# EAGLE design ECNG3020 (EAGLE 9.5.1)
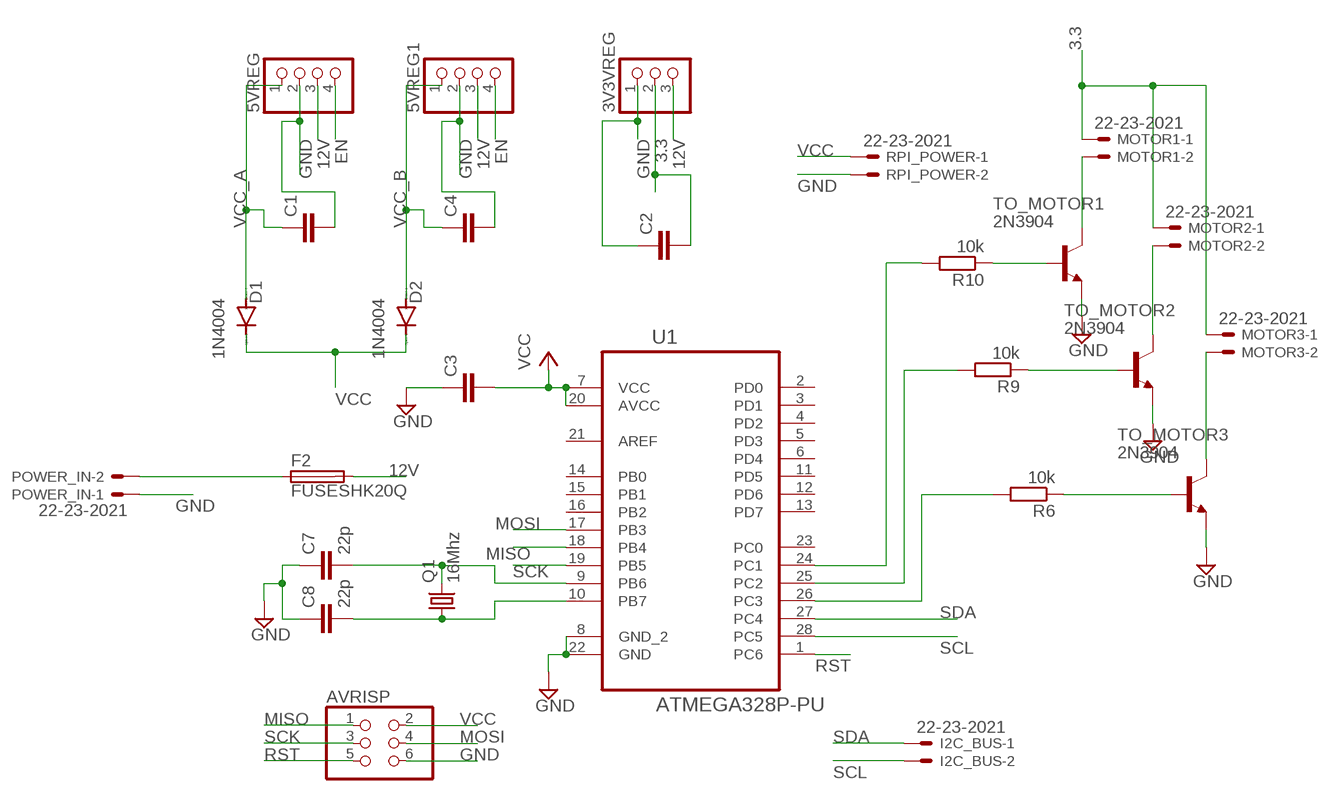
[diagram p0: schematic, sheet 1]

## Parts
3V3VREG  PINHD-1X3M  [1X03M]
5VREG  PINHD-1X4M  [1X04M]
5VREG1  PINHD-1X4M  [1X04M]
AVRISP  PINHD-2X3  [2X03]
C1  C2,5-3  [C2.5-3]
C2  C2,5-3  [C2.5-3]
C3  C2,5-3  [C2.5-3]
C4  C2,5-3  [C2.5-3]
C7  22p  C-EU050-024X044  [C050-024X044]
C8  22p  C-EU050-024X044  [C050-024X044]
D1  1N4004  [DO41-10]
D2  1N4004  [DO41-10]
F2  FUSESHK20Q  [SHK20Q]
I2C_BUS  22-23-2021  [22-23-2021]
MOTOR1  22-23-2021  [22-23-2021]
MOTOR2  22-23-2021  [22-23-2021]
MOTOR3  22-23-2021  [22-23-2021]
POWER_IN  22-23-2021  [22-23-2021]
Q1  16Mhz  CRYSTALHC49S  [HC49/S]
R6  10k  R-EU_0207/10  [0207/10]
R9  10k  R-EU_0207/10  [0207/10]
R10  10k  R-EU_0207/10  [0207/10]
RPI_POWER  22-23-2021  [22-23-2021]
TO_MOTOR1  2N3904  [TO92]
TO_MOTOR2  2N3904  [TO92]
TO_MOTOR3  2N3904  [TO92]
U1  ATMEGA328P-PU  [DIP254P762X457-28]

## Nets
3.3: 3V3VREG.2 C2.2 MOTOR1.1 MOTOR2.1 MOTOR3.1
12V: 3V3VREG.3 5VREG1.3 5VREG.3 F2.2A
EN: 5VREG1.4 5VREG.4
GND: 3V3VREG.1 5VREG1.2 5VREG.2 AVRISP.6 C1.2 C2.1 C3.1 C4.2 C7.1 C8.1 POWER_IN.1 RPI_POWER.2 TO_MOTOR1.3(E) TO_MOTOR2.3(E) TO_MOTOR3.3(E) U1.8(GND_2) U1.22(GND)
MISO: AVRISP.1 U1.18(PB4)
MOSI: AVRISP.4 U1.17(PB3)
N$1: R10.2 U1.24(PC1)
N$2: R9.2 U1.25(PC2)
N$3: C7.2 Q1.2 U1.9(PB6)
N$4: R6.2 U1.26(PC3)
N$5: C8.2 Q1.1 U1.10(PB7)
N$6: R10.1 TO_MOTOR1.2(B)
N$10: MOTOR3.2 TO_MOTOR3.1(C)
N$11: MOTOR2.2 TO_MOTOR2.1(C)
N$12: MOTOR1.2 TO_MOTOR1.1(C)
N$13: F2.1A POWER_IN.2
N$14: R9.1 TO_MOTOR2.2(B)
N$15: R6.1 TO_MOTOR3.2(B)
RST: AVRISP.5 U1.1(PC6)
SCK: AVRISP.3 U1.19(PB5)
SCL: I2C_BUS.2 U1.28(PC5)
SDA: I2C_BUS.1 U1.27(PC4)
VCC: AVRISP.2 C3.2 D1.C D2.C RPI_POWER.1 U1.7(VCC) U1.20(AVCC)
VCC_A: 5VREG.1 C1.1 D1.A
VCC_B: 5VREG1.1 C4.1 D2.A
Unconnected: U1.2(PD0) U1.3(PD1) U1.4(PD2) U1.5(PD3) U1.6(PD4) U1.11(PD5) U1.12(PD6) U1.13(PD7) U1.14(PB0) U1.15(PB1) U1.16(PB2) U1.21(AREF) U1.23(PC0)

## Library data of the parts
3V3VREG = pinhead_2:PINHD-1X3: PIN HEADER
5VREG 5VREG1 = pinhead_2:PINHD-1X4: PIN HEADER
AVRISP = pinhead_2:PINHD-2X3: PIN HEADER
C1-C4 = capacitor-wima:C: CAPACITOR naming: grid - package width
C7 C8 = rcl:C-EU: CAPACITOR, European symbol; SPICEPREFIX: C
D1 D2 = diode:1N4004: DIODE general purpose rectifier, 1 A
F2 = fuse:FUSE: Fuse; OC_FARNELL: unknown; OC_NEWARK: unknown
I2C_BUS MOTOR1-MOTOR3 POWER_IN RPI_POWER = con-molex:22-23-2021: .100" (2.54mm) Center Header - 2 Pin; MF: MOLEX; MPN: 22-23-2021; OC_FARNELL: 1462926; OC_NEWARK: 25C3832
Q1 = crystal:CRYSTAL: CRYSTAL; OC_FARNELL: 1667008; OC_NEWARK: unknown
R6 R9 R10 = rcl:R-EU_: RESISTOR, European symbol; SPICEPREFIX: R
TO_MOTOR1-TO_MOTOR3 = transistor-neu-to92:2N3904: NPN TRANSISTOR
U1 = ATMEGA328P-PU:ATMEGA328P-PU: 8-bit Microcontroller with In-System Programmable Flash Buy Part <https://snapeda.com/parts/ATMEGA328P-PU/Microchip/view-part/?ref=eda>; AVAILABILITY: Good; DESCRIPTION: AVR AVR® ATmega Microcontroller IC 8-Bit 20MHz 32KB (16K x 16) FLASH 28-PDIP; DIGIKEY-PURCHASE-URL: https://snapeda.com/shop?store=DigiKey&id=2895131; MF: Microchip; MOUSER-PURCHASE-URL: https://snapeda.com/shop?store=Mouser&id=2895131; MP: ATMEGA328P-PU; PACKAGE: DIP-28 Generic; PRICE: None

## Board
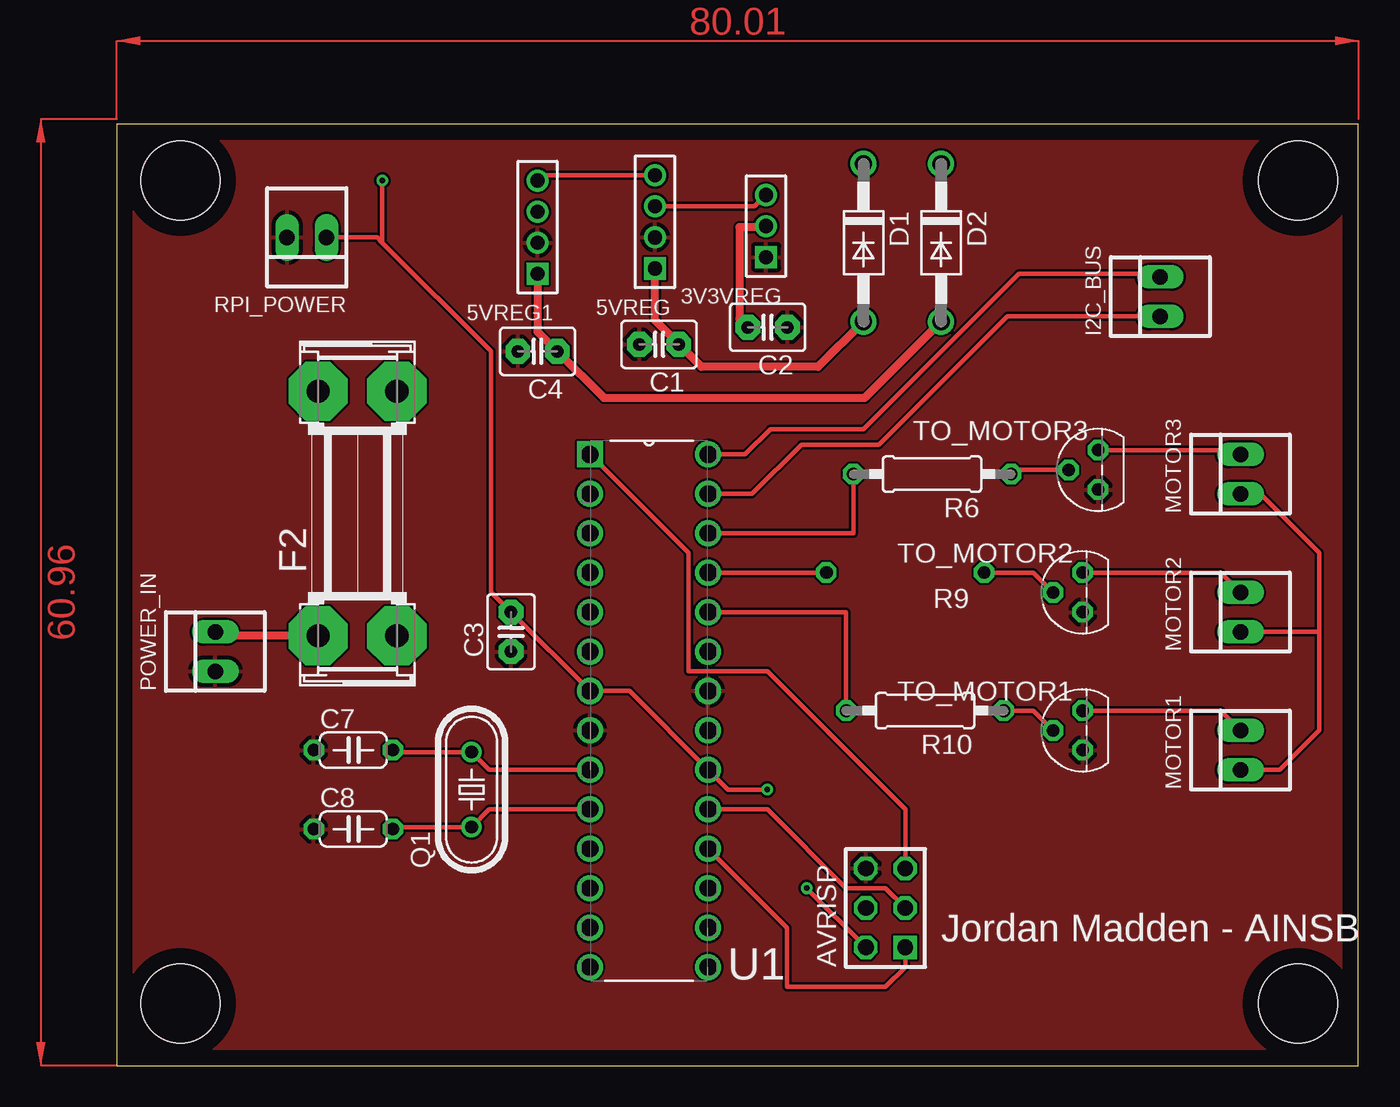
[diagram p1: board, top side]
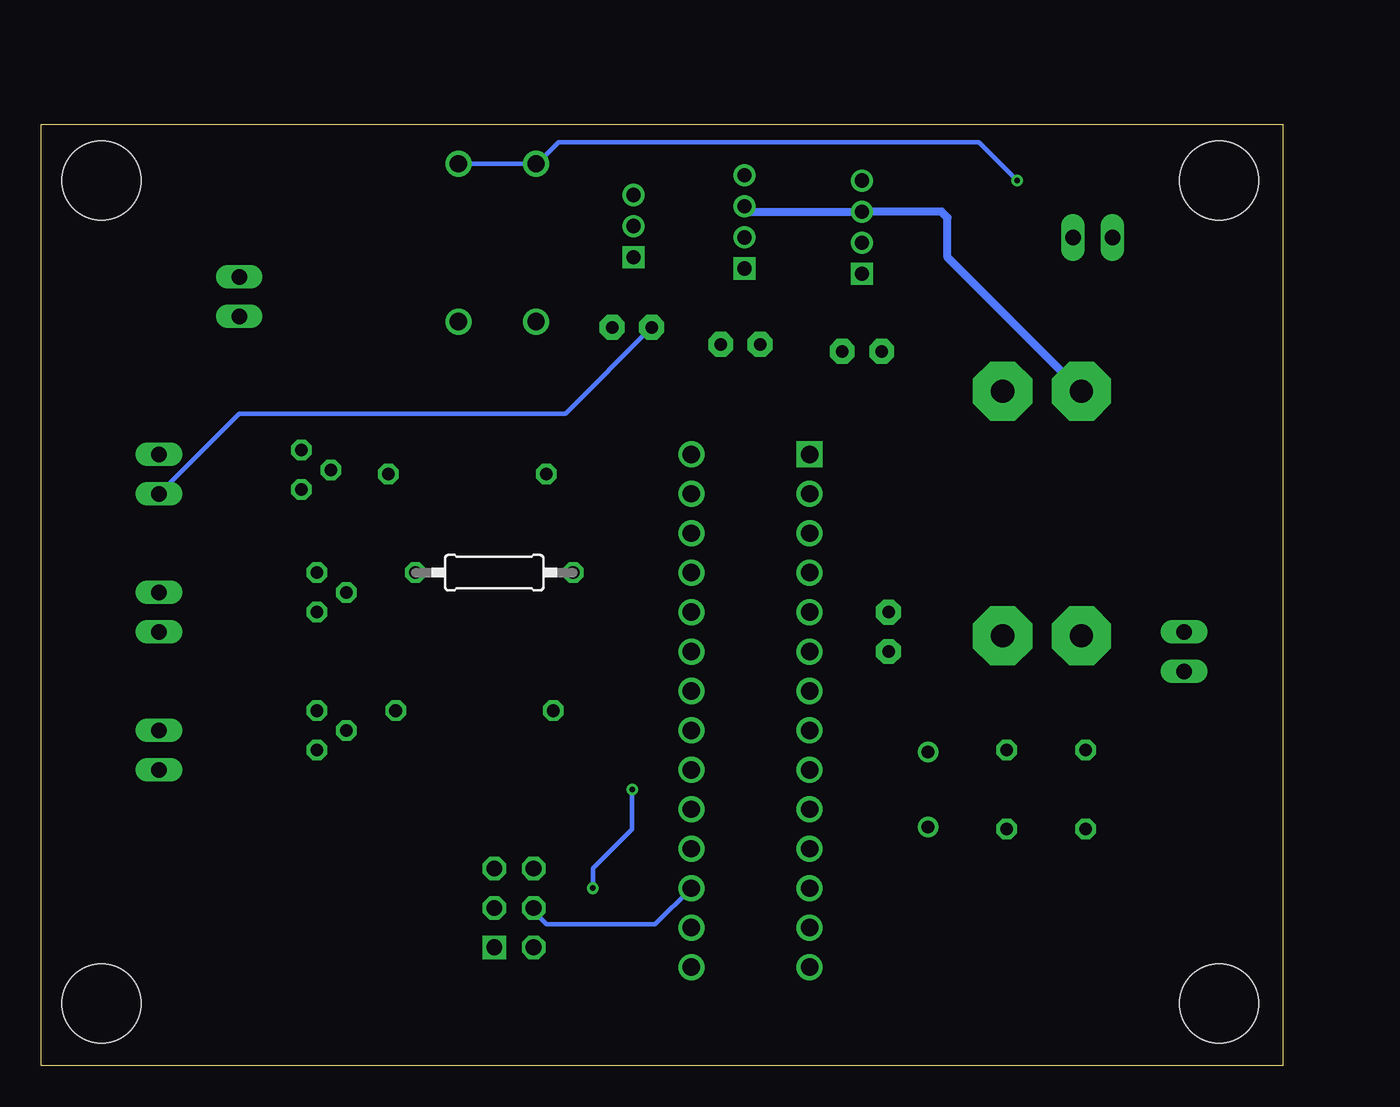
[diagram p2: board, bottom side, seen from below]

Size 79.99 x 60.63 mm. Coordinates in mm from the lower left corner, seen from the top.
Outline: 0,0 79.99,0 79.99,60.63 0,60.63 0,0
Copper layers (1*16): Top 0.035mm / dielectric 1.5mm / Bottom 0.035mm
Design rules "default": minimum track width 6mil, minimum drill 0.35mm, track to track 6mil, track to pad 6mil, pad to pad 6mil, via to via 6mil, smd to smd 6mil, copper to edge 40mil, drill to drill 6mil, minimum pad ring 10mil, minimum via ring 8mil, stop-mask expansion 4mil, vias tented up to drill 0mil, thermal gap 10mil
Holes 5.08 mm at 4.11,57 76.11,57 76.11,4 4.11,4

### Footprints (pad centres in the part's own frame; a part is rotated, then mirrored left to right if it is on the bottom)
1X03M = drill 0.914 square: 1 -2,0 | drill 0.914: 2 0,0; 3 2,0
1X04M = drill 0.914 square: 1 -3,0 | drill 0.914: 2 -1,0; 3 1,0; 4 3,0
2X03 = drill 1.016 square: 1 -2.54,-1.27 | drill 1.016 octagon: 2 -2.54,1.27; 3 0,-1.27; 4 0,1.27; 5 2.54,-1.27; 6 2.54,1.27
C2.5-3 = drill 0.813 pad 1.6 octagon: 1 -1.27,0; 2 1.27,0
C050-024X044 = drill 0.813 octagon: 1 -2.54,0; 2 2.54,0
DO41-10 = drill 1.118: A 5.08,0; C -5.08,0
SHK20Q = drill 1.5 pad 3.81 octagon: 1A -7.874,2.54; 1B -7.874,-2.54; 2A 7.874,2.54; 2B 7.874,-2.54
22-23-2021 = drill 1 long: 1 -1.27,0; 2 1.27,0
HC49/S = drill 0.813: 1 -2.413,0; 2 2.413,0
0207/10 = drill 0.813 octagon: 1 -5.08,0; 2 5.08,0
TO92 = drill 0.813 octagon: 1 1.27,0; 2 0,1.905; 3 -1.27,0
DIP254P762X457-28 = drill 1.118 square: 1 -7.62,33.02 | drill 1.118: 2 -7.62,30.48; 3 -7.62,27.94; 4 -7.62,25.4; 5 -7.62,22.86; 6 -7.62,20.32; 7 -7.62,17.78; 8 -7.62,15.24; 9 -7.62,12.7; 10 -7.62,10.16; 11 -7.62,7.62; 12 -7.62,5.08; 13 -7.62,2.54; 14 -7.62,0; 15 0,0; 16 0,2.54; 17 0,5.08; 18 0,7.62; 19 0,10.16; 20 0,12.7; 21 0,15.24; 22 0,17.78; 23 0,20.32; 24 0,22.86; 25 0,25.4; 26 0,27.94; 27 0,30.48; 28 0,33.02

### Placement (x,y rotation side)
3V3VREG  41.83,54.07 90 top
5VREG  34.67,54.34 90 top
5VREG1  27.11,54 90 top
AVRISP  49.53,10.16 90 top
C1  34.94,46.45 180 top
C2  41.93,47.55 180 top
C3  25.4,27.94 90 top
C4  27.11,46 180 top
C7  15.24,20.32 0 top
C8  15.24,15.24 0 top
D1  48.11,53 270 top
D2  53.11,53 270 top
F2  15.51,35.56 90 top
I2C_BUS  67.23,49.53 90 top
MOTOR1  72.39,20.32 90 top
MOTOR2  72.39,29.21 90 top
MOTOR3  72.39,38.1 90 top
POWER_IN  6.35,26.67 90 top
Q1  22.86,17.78 90 top
R6  52.53,38.1 180 top
R9  50.8,31.75 0 bottom
R10  52.07,22.86 180 top
RPI_POWER  12.24,53.34 180 top
TO_MOTOR1  62.23,21.59 90 top
TO_MOTOR2  62.23,30.48 90 top
TO_MOTOR3  63.23,38.37 90 top
U1  38.1,6.35 0 top

### Tracks (layer width: path | path; a pad name or v marks a point on that pad's centre or on a via)
3.3
  Top 0.305: MOTOR3.1 73.66,36.83 77.47,33.02 77.47,27.94 | 77.47,27.94 77.47,21.59 74.93,19.05 MOTOR1.1 | MOTOR2.1 77.47,27.94
  Top 0.508: 3V3VREG.2 41.76,54 40.11,54 40.11,48.1 C2.2
  Bottom 0.305: C2.2 46.21,42 67.22,42 MOTOR3.1
12V
  Top 0.305: 3V3VREG.3 41.1,55.34 5VREG.3
  Bottom 0.508: F2.2A 21.59,52.05 21.59,54.61 21.98,55 5VREG1.3 34.33,55 5VREG.3 34.4,55.61
EN
  Top 0.305: 5VREG.4 27.45,57.34 5VREG1.4
GND
  pour Top: 0,0 80.01,0 80.01,60.96 0,60.96
MISO
  Top 0.305: U1.18 43.18,8.89 43.18,5.08 49.53,5.08 50.8,6.35 AVRISP.1
MOSI
  Bottom 0.305: AVRISP.4 48.5,10.16 47.43,9.09 40.44,9.09 U1.17
N$1
  Top 0.305: U1.24 46.99,29.21 R10.2
N$2
  Top 0.305: U1.25 R9.2
N$3
  Top 0.305: U1.9 24,19.05 Q1.2 17.91,20.19 C7.2
N$4
  Top 0.305: U1.26 47.45,34.29 R6.2
N$5
  Top 0.305: U1.10 24,16.51 Q1.1 17.91,15.37 C8.2
N$6
  Top 0.305: TO_MOTOR1.2 59.05,22.86 R10.1
N$10
  Top 0.305: MOTOR3.2 72.12,39.64 TO_MOTOR3.1
N$11
  Top 0.305: MOTOR2.2 71.12,31.75 TO_MOTOR2.1
N$12
  Top 0.305: TO_MOTOR1.1 71.12,22.86 MOTOR1.2
N$13
  Top 0.508: F2.1A 6.6,27.69 POWER_IN.2
N$14
  Top 0.305: R9.1 59.05,31.75 TO_MOTOR2.2
N$15
  Top 0.305: TO_MOTOR3.2 57.88,38.37 R6.1
RST
  Top 0.305: U1.1 36.83,33.02 36.83,25.4 41.91,25.4 50.8,16.51 AVRISP.5
SCK
  Top 0.305: 39.13,16.51 U1.19 41.91,16.51 46.99,11.43 49.53,11.43 AVRISP.3
SCL
  Top 0.305: U1.28 40.48,39.37 42.11,41 48.11,41 58.11,51 67.03,51 I2C_BUS.2
SDA
  Top 0.305: I2C_BUS.1 57.37,48.26 49.11,40 44.11,40 40.94,36.83 U1.27
VCC  (via drill 0.35)
  Top 0.305: AVRISP.2 v44.45,11.43 | v41.91,17.78 39.37,17.78 U1.20 33.02,24.13 U1.7 C3.2 24.11,30.5 24.11,46 17.11,53 | 17.11,53 16.77,53.34 RPI_POWER.1 | 17.11,53 v17.11,57
  Bottom 0.305: v44.45,11.43 44.45,12.7 41.91,15.24 v41.91,17.78 | D2.C D1.C 48.03,58.08 46.65,59.46 22.11,59.46 21.57,59.46 19.57,59.46 v17.11,57
VCC_A
  Top 0.508: D1.A 45.19,45 37.66,45 C1.1 34.67,47.99 5VREG.1
VCC_B
  Top 0.508: 5VREG1.1 27.11,47.27 C4.1 31.38,43 48.19,43 D2.A
(copper drawn outside any net)
  shapes: Top area x2

### Text on the board
tPlace: Jordan Madden - AINSB